# Altium schematic sheet Smoothing_shematic_2022-05-04.schdoc
size 102 x 83 mm
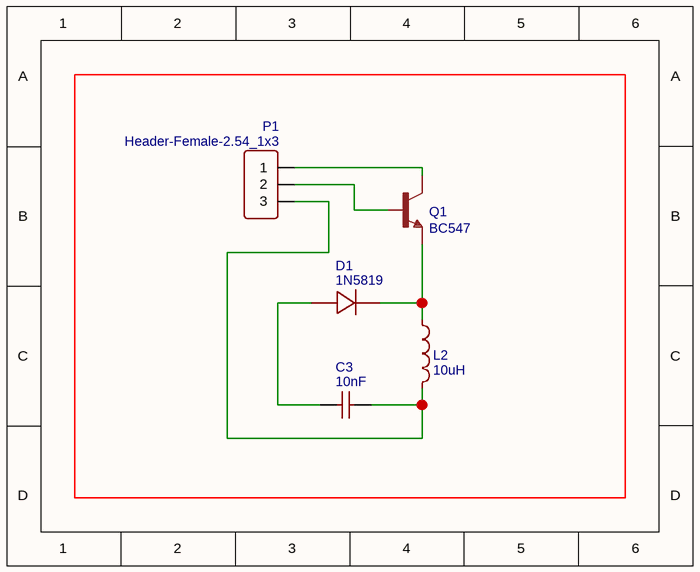
[diagram p0: Smoothing_shematic_2022-05-04.schdoc]

## Parts
C3  10nF  [CAP-TH_L3.5-W3.0-P2.54-D0.8]
D1  1N5819  [DO-41_BD2.4-L4.7-P8.70-D0.9-RD]
L2  10uH  [IND-TH_BD4.0-L6.0-P10.00-D0.5]
P1  Header-Female-2.54_1x3  [HDR-TH_3P-P2.54-V-F]
Q1  BC547  [TO-92]

## Nets
NetC3_1: C3.1 D1.2(A)
NetC3_2: C3.2 L2.2 P1.3
NetD1_1: D1.1(K) L2.1 Q1.3(E)
NetP1_1: P1.1 Q1.1(C)
NetP1_2: P1.2 Q1.2(B)

## Library data of the parts
C3 = 10nF: BOM_Manufacturer: ReliaPro; BOM_Manufacturer Part: 22pf/50V 10%; nameAlias: Capacitance; BOM_Supplier: LCSC; BOM_Supplier Part: C9316; spicePre: C; spiceSymbolName: 22pF
D1 = 1N5819: BOM_Manufacturer: GD; Contributor: LCSC; BOM_Supplier: LCSC; BOM_Supplier Part: C256527; BOM_Manufacturer Part: 1N5819; BOM_JLCPCB Part Class: Extended Part; spicePre: D; spiceSymbolName: 1N5819_C256527
L2 = 10uH: BOM_Manufacturer: ReliaPro; BOM_Manufacturer Part: General Inductor(TH)/10uH电感; nameAlias: Value; BOM_Supplier: LCSC; BOM_Supplier Part: C27938; BOM_JLCPCB Part Class: Extended Part; Inductance: 10uH; spicePre: L; spiceSymbolName: General Inductor(TH)/10uH
P1 = Header-Female-2.54_1x3: BOM_Manufacturer: Boom Precision Elec; BOM_Supplier Part: C146243; BOM_Supplier: LCSC; BOM_Manufacturer Part: Header-Female-2.54_1x3; link: https://datasheet.lcsc.com/szlcsc/Boom-Precision-Elec-2-54mm-1-8P-Straight-Female-header_C27438.pdf; BOM_JLCPCB Part Class: Extended Part; spicePre: P; spiceSymbolName: Header-Female-2.54_1x3
Q1 = BC547: catid: 20; description: Generic NPN BJT; Contributor: SparkFun; sourceId: m0Xx7trpY; BOM_Manufacturer Part: ?; spicePre: Q